# Altium schematic sheet DS141-1.1-C循环式二氧化碳.SchDoc
size A4; SheetNumber: 2; SheetTotal: 2
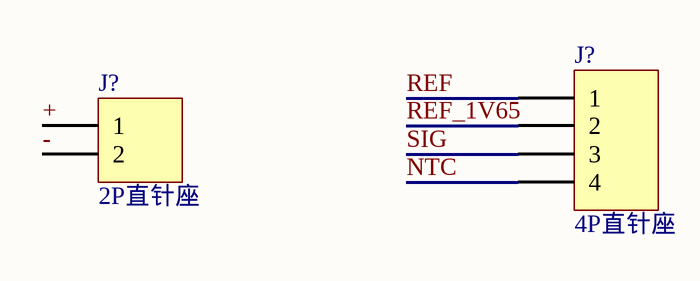
[diagram p0: DS141-1.1-C循环式二氧化碳.SchDoc]

## Parts
(Parts that share a designator on the sheet are numbered #1, #2 ... from top to bottom, then left to right.)
J?#1  value 4P直针座  [JX-CO2-2 A]  (hidden comment: SL000000029)
J?#2  value 2P直针座  [HSL-5-115]  (hidden comment: SL000000027)

## Nets
+: J?#2.1
-: J?#2.2
NTC: J?#1.4
REF: J?#1.1
REF_1V65: J?#1.2
SIG: J?#1.3

## Library data of the parts
J?#1 = XH2.54mm-4A 直针座: 4P直针座
J?#2 = XH2.54mm-2A 直针座: 2P直针座